# Altium schematic sheet notasGenerales.SchDoc
size A
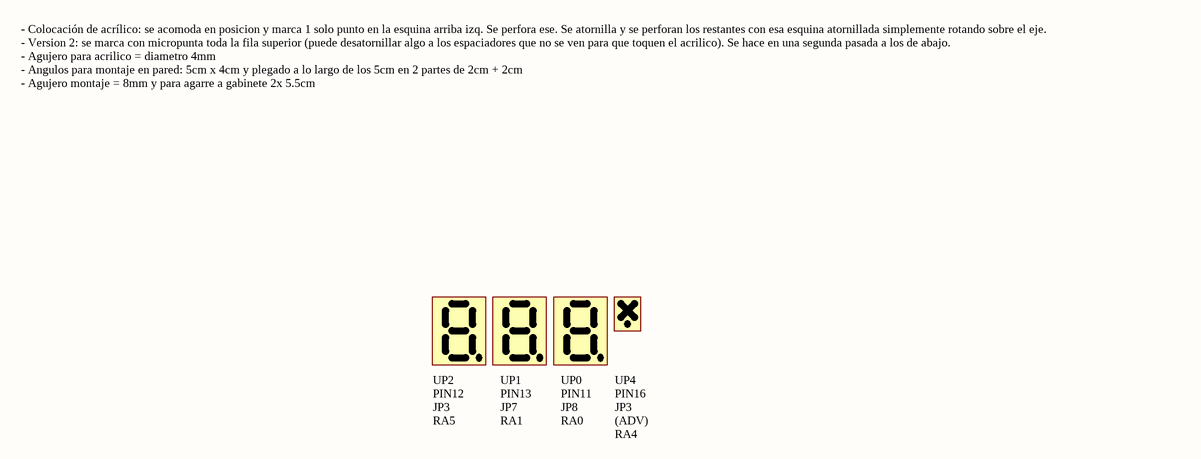
[diagram p0: notasGenerales.SchDoc]

## Notes on the sheet
- - Colocación de acrílico: se acomoda en posicion y marca 1 solo punto en la esquina arriba izq. Se perfora ese. Se atornilla y se perforan los restantes con esa esquina atornillada simplemente rotando sobre el eje.
  - Version 2: se marca con micropunta toda la fila superior (puede desatornillar algo a los espaciadores que no se ven para que toquen el acrilico). Se hace en una segunda pasada a los de abajo.
  - Agujero para acrilico = diametro 4mm
  - Angulos para montaje en pared: 5cm x 4cm y plegado a lo largo de los 5cm en 2 partes de 2cm + 2cm
  - Agujero montaje = 8mm y para agarre a gabinete 2x 5.5cm
- UP2
  PIN12
  JP3
  RA5
- UP1
  PIN13
  JP7
  RA1
- UP0
  PIN11
  JP8
  RA0
- UP4
  PIN16
  JP3 (ADV)
  RA4